# EAGLE design sensors (EAGLE 7.7.0)
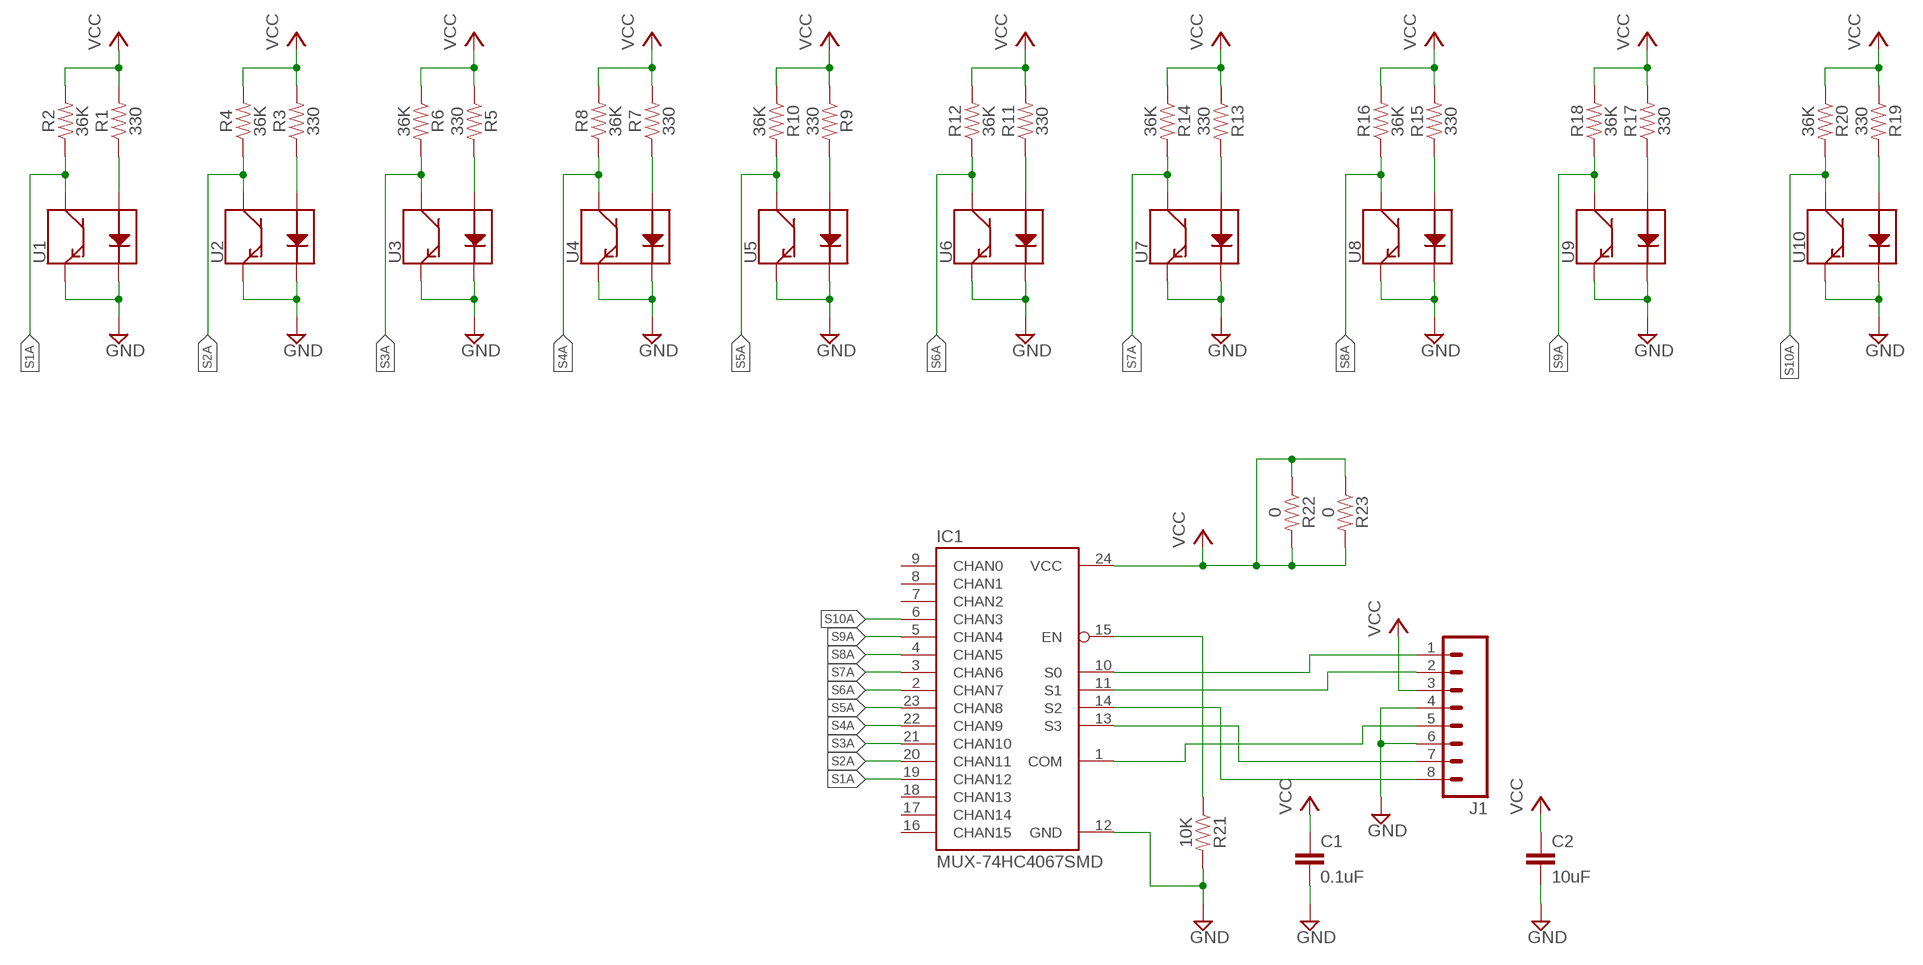
[diagram p0: schematic, sheet 1]

## Parts
C1  0.1uF  1.0UF-0805-25V-(+80/-20%)  [0805]
C2  10uF  1.0UF-0805-25V-(+80/-20%)  [0805]
IC1  MUX-74HC4067SMD  [SSOP24]
J1  M08  [1X08_ROUND]
R1  330  RESISTOR0805  [0805]
R2  36K  RESISTOR0805  [0805]
R3  330  RESISTOR0805  [0805]
R4  36K  RESISTOR0805  [0805]
R5  330  RESISTOR0805  [0805]
R6  36K  RESISTOR0805  [0805]
R7  330  RESISTOR0805  [0805]
R8  36K  RESISTOR0805  [0805]
R9  330  RESISTOR0805  [0805]
R10  36K  RESISTOR0805  [0805]
R11  330  RESISTOR0805  [0805]
R12  36K  RESISTOR0805  [0805]
R13  330  RESISTOR0805  [0805]
R14  36K  RESISTOR0805  [0805]
R15  330  RESISTOR0805  [0805]
R16  36K  RESISTOR0805  [0805]
R17  330  RESISTOR0805  [0805]
R18  36K  RESISTOR0805  [0805]
R19  330  RESISTOR0805  [0805]
R20  36K  RESISTOR0805  [0805]
R21  10K  RESISTOR0805  [0805]
R22  0  RESISTOR0805  [0805]
R23  0  RESISTOR0805  [0805]
U1  QRE1113SMD-W  [QRE1113-W]
U2  QRE1113SMD-W  [QRE1113-W]
U3  QRE1113SMD-W  [QRE1113-W]
U4  QRE1113SMD-W  [QRE1113-W]
U5  QRE1113SMD-W  [QRE1113-W]
U6  QRE1113SMD-W  [QRE1113-W]
U7  QRE1113SMD-W  [QRE1113-W]
U8  QRE1113SMD-W  [QRE1113-W]
U9  QRE1113SMD-W  [QRE1113-W]
U10  QRE1113SMD-W  [QRE1113-W]

## Nets
GND: C1.2 C2.2 IC1.12(GND) J1.4 J1.6 R21.2 U1.2(K) U1.4(E) U2.2(K) U2.4(E) U3.2(K) U3.4(E) U4.2(K) U4.4(E) U5.2(K) U5.4(E) U6.2(K) U6.4(E) U7.2(K) U7.4(E) U8.2(K) U8.4(E) U9.2(K) U9.4(E) U10.2(K) U10.4(E)
N$1: R1.1 U1.1(A)
N$2: IC1.13(S3) J1.7
N$3: R3.1 U2.1(A)
N$4: IC1.15(EN) R21.1
N$5: R5.2 U3.1(A)
N$6: IC1.14(S2) J1.8
N$7: R7.1 U4.1(A)
N$8: IC1.10(S0) J1.1
N$9: R9.2 U5.1(A)
N$10: IC1.11(S1) J1.2
N$11: R11.1 U6.1(A)
N$12: IC1.1(COM) J1.5
N$13: R13.2 U7.1(A)
N$15: R15.1 U8.1(A)
N$17: R17.1 U9.1(A)
N$19: R19.2 U10.1(A)
S1A: IC1.19(CHAN12) R2.1 U1.3(C)
S2A: IC1.20(CHAN11) R4.1 U2.3(C)
S3A: IC1.21(CHAN10) R6.2 U3.3(C)
S4A: IC1.22(CHAN9) R8.1 U4.3(C)
S5A: IC1.23(CHAN8) R10.2 U5.3(C)
S6A: IC1.2(CHAN7) R12.1 U6.3(C)
S7A: IC1.3(CHAN6) R14.2 U7.3(C)
S8A: IC1.4(CHAN5) R16.1 U8.3(C)
S9A: IC1.5(CHAN4) R18.1 U9.3(C)
S10A: IC1.6(CHAN3) R20.2 U10.3(C)
VCC: C1.1 C2.1 IC1.24(VCC) J1.3 R1.2 R2.2 R3.2 R4.2 R5.1 R6.1 R7.2 R8.2 R9.1 R10.1 R11.2 R12.2 R13.1 R14.1 R15.2 R16.2 R17.2 R18.2 R19.1 R20.1 R22.1 R22.2 R23.1 R23.2
Unconnected: IC1.7(CHAN2) IC1.8(CHAN1) IC1.9(CHAN0) IC1.16(CHAN15) IC1.17(CHAN14) IC1.18(CHAN13)

## Library data of the parts
C1 C2 = SparkFun-Capacitors:1.0UF: 1µF ceramic capacitors A capacitor is a passive two-terminal electrical component used to store electrical energy temporarily in an electric field.; PROD_ID: CAP-11625; VALUE: 1.0uF
IC1 = SeguidorLineasLbr:MUX-74HC4067
J1 = SparkFun-Connectors:M08: Header 8 Standard 8-pin 0.1" header. Use with straight break away headers (SKU : PRT-00116), right angle break away headers (PRT-00553), swiss pins (PRT-00743), machine pins (PRT-00117), and female headers (PRT-00115).; PROD_ID: CONN-08437
R1-R23 = SparkFun-Resistors:RESISTOR: Generic Resistor Package
U1-U10 = SparkFun-Sensors:QRE1113: QRE1113 Reflective Object Sensor The QRE1113 is a small IR reflectance sensor. This sensor is often used in line following robots because, if it can sense if a surface is white or black. There are four pins on the QRE1113 - two control the IR emitting LED while the other two are the collector and emitter of a phototransistor. The IR diode has a max forward current of 50mA and operates at 940nm. Datasheet <http://www.sparkfun.com/datasheets/Components/SMD/QRE1113.GR.pdf> SparkFun Products IR Reflectance Sensor - QRE1113 <https://www.sparkfun.com/products/9542> (COM-09542) SparkFun Line Sensor Breakout - QRE1113 (Analog) <https://www.sparkfun.com/products/9453> (ROB-09453) SparkFun Line Sensor Breakout - QRE1113 (Digital) <https://www.sparkfun.com/products/9454> (ROB-09454) SparkFun RedBot Sensor - Line Follower <https://www.sparkfun.com/products/11769> (SEN-11769) SparkFun RedBot Sensor - Wheel Encoder <https://www.sparkfun.com/products/12617> (SEN-12617) SparkFun Line Follower Array <https://www.sparkfun.com/products/13582> (SEN-13582); PROD_ID: IC-09357; SF_ID: COM-09542

## Board
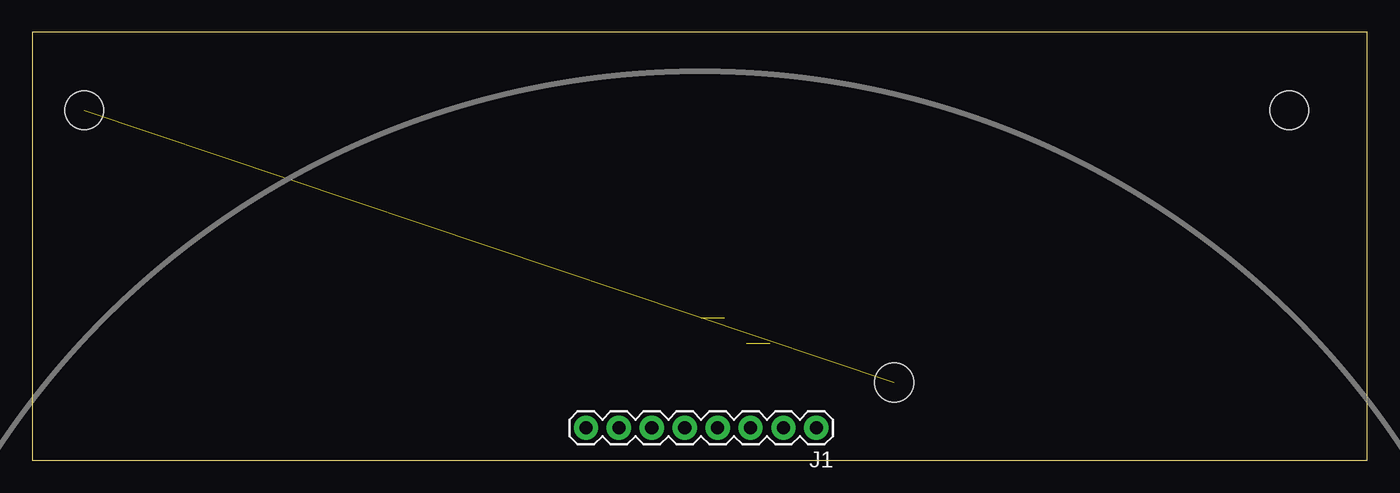
[diagram p1: board, top side]
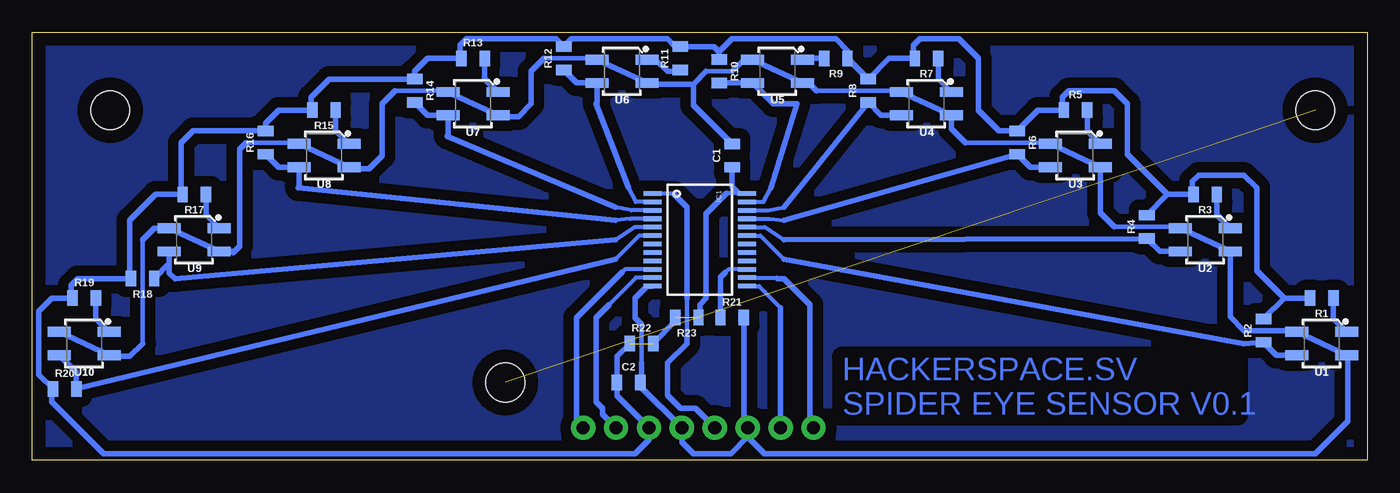
[diagram p2: board, bottom side, seen from below]

Size 103 x 33 mm. Coordinates in mm from the lower left corner, seen from the top.
Outline: 0,0 103,0 103,33 0,33 0,0
Copper layers (1*16): Top 0.035mm / dielectric 1.5mm / Bottom 0.035mm
Design rules "default": minimum track width 10mil, minimum drill 24mil, track to track 8mil, track to pad 8mil, pad to pad 8mil, via to via 8mil, smd to smd 8mil, copper to edge 40mil, drill to drill 8mil, minimum pad ring 10mil, minimum via ring 8mil, stop-mask expansion 4mil, vias tented up to drill 0mil, thermal gap 10mil
Holes 3 mm at 66.5,6 97,27 4,27

### Footprints (pad centres in the part's own frame; a part is rotated, then mirrored left to right if it is on the bottom)
0805 = smd 0.8 x 1.2: 1 -0.9,0; 2 0.9,0
SSOP24 = smd 0.348 x 1.397: 1 -3.575,-3.656; 2 -2.925,-3.656; 3 -2.275,-3.656; 4 -1.625,-3.656; 5 -0.975,-3.656; 6 -0.325,-3.656; 7 0.325,-3.656; 8 0.975,-3.656; 9 1.625,-3.656; 10 2.275,-3.656; 11 2.925,-3.656; 12 3.575,-3.656; 13 3.575,3.656; 14 2.925,3.656; 15 2.275,3.656; 16 1.625,3.656; 17 0.975,3.656; 18 0.325,3.656; 19 -0.325,3.656; 20 -0.975,3.656; 21 -1.625,3.656; 22 -2.275,3.656; 23 -2.925,3.656; 24 -3.575,3.656
1X08_ROUND = drill 1.016 pad 1.88: 1 0,0; 2 2.54,0; 3 5.08,0; 4 7.62,0; 5 10.16,0; 6 12.7,0; 7 15.24,0; 8 17.78,0
QRE1113-W = smd 1.778 x 0.762: 1 -1.927,-0.9; 2 1.927,-0.9; 3 1.927,0.9; 4 -1.927,0.9

### Placement (x,y rotation side)
C1  49,23.5 90 bottom
C2  57,6 0 bottom
IC1  51.5,17 270 bottom
J1  60.5,2.5 180 top
R1  3.5,12.5 180 bottom
R2  8,10 90 bottom
R3  12.5,20.5 180 bottom
R4  17,18 90 bottom
R5  22.5,27 0 bottom
R6  27,24.5 270 bottom
R7  34,31 180 bottom
R8  38.5,28.5 90 bottom
R9  41,31 180 bottom
R10  50,30 270 bottom
R11  53,31 90 bottom
R12  62,31 90 bottom
R13  69,31 0 bottom
R14  73.5,28.5 270 bottom
R15  80.5,27 180 bottom
R16  85,24.5 90 bottom
R17  90.5,20.5 180 bottom
R18  94.5,14 180 bottom
R19  99,12.5 0 bottom
R20  100.5,5.5 0 bottom
R21  49,11 0 bottom
R22  56,9 0 bottom
R23  52.5,11 180 bottom
U1  3.5,9 180 bottom
U2  12.5,17 180 bottom
U3  22.5,23.5 180 bottom
U4  34,27.5 180 bottom
U5  45.5,30 180 bottom
U6  57.5,30 180 bottom
U7  69,27.5 180 bottom
U8  80.5,23.5 180 bottom
U9  90.5,17 180 bottom
U10  99,9 180 bottom

### Tracks (layer width: path | path; a pad name or v marks a point on that pad's centre or on a via)
GND
  Bottom 0.356: 14.5,18 19.5,18 | 24.53,24.5 31,24.5 | 36.03,28.5 42.5,28.5 | 49,30 51,30 | 59.53,31 63.5,31 | 71.03,28.5 75,28.5 | 82.53,24.5 86.5,24.5 | 94.5,17 94.5,9 | 56,7.5 56,10.5
  Bottom 0.406: U10.2 U10.4 96.97,8 95.5,8 94.5,9 | 14.5,18 14.5,17.97 U2.2 U2.4 10.57,11.07 9.5,10 5.53,10 U1.2 U1.4 1.5,8.03 1.5,3 4,0.5 46.5,0.5 47.8,1.8 | 19.5,18 20.57,19.07 U3.4 U3.2 24.53,24.5 | 31,24.5 32.07,25.57 U4.4 U4.2 36.03,28.5 | 42.5,28.5 43.1,29.1 U5.4 U5.2 48.1,30.9 49,30 | 51,30 52,29 | 52,29 55.47,29 U6.4 U6.2 59.53,31 | 63.5,31 64.5,30 64.5,27.5 65.5,26.5 66.97,26.5 U7.4 U7.2 71.03,28.5 | 75,28.5 76,27.5 76,23.5 77,22.5 78.47,22.5 arc90 U8.4 U8.2 82.53,24.5 | 86.5,24.5 87,24 87,16.5 87.5,16 87.6,16.1 U9.4 U9.2 93.6,17.9 94.5,17 | 47.8,1.8 J1.6 48.1,2.8 R21.2 | 47.8,1.8 49.1,0.5 52,0.5 52.88,1.38 J1.4 56.1,5.72 C2.2 56,6.1 56,7.5 | C1.2 52,27.4 52,29 | IC1.12 55.58,13.43 56.5,12.5 56.5,11 56,10.5
N$1
  Bottom 0.406: U1.1 2.6,10.93 R1.1
N$2
  Bottom 0.305: IC1.13 46.92,13.43 46.5,13 45.26,11.76
  Bottom 0.406: 45.26,11.76 J1.7
N$3
  Bottom 0.406: U2.1 11.6,18.93 R3.1
N$4
  Bottom 0.305: IC1.15 49.27,14.72 49.5,14.5
  Bottom 0.406: 49.5,14.5 49.9,14.1 R21.1
N$5
  Bottom 0.406: U3.1 21.6,25.43 R5.2
N$6
  Bottom 0.305: IC1.14 45.58,14.07 arc90 45.5,14
  Bottom 0.406: 45.5,14 45,14 43,12 43,2.78 J1.8
N$7
  Bottom 0.406: U4.1 33.1,29.43 R7.1
N$8
  Bottom 0.305: IC1.10 57.27,14.72 57.5,14.5
  Bottom 0.406: 57.5,14.5 61,11 61,3 J1.1
N$9
  Bottom 0.406: U5.1 43.47,31 R9.2
N$10
  Bottom 0.305: IC1.11 56.42,14.07 58.5,12
  Bottom 0.406: J1.2 59,3.54 59,4 59.5,4.5 59.5,11 58.5,12
N$11
  Bottom 0.406: R11.1 53.1,30 54,30 54.9,30.9 U6.1
N$12
  Bottom 0.305: IC1.1 53.58,20.57 53.5,20.5
  Bottom 0.356: 52.5,9.5 52.5,12.5
  Bottom 0.406: 53.5,20.5 52.5,19.5 52.5,12.5 | J1.5 51.84,4 53,4 54,5 54,7.5 52.5,9 52.5,9.5
N$13
  Bottom 0.406: U7.1 68.1,29.43 R13.2
N$14
  pour Bottom (isolate 0.813): 0,0 0,33 103,33 103,0
N$15
  Bottom 0.406: U8.1 79.6,25.43 R15.1
N$16  (via drill 1)  (1 unrouted)
  other vias: 66.5,6 4,27 97,27
N$17
  Bottom 0.406: U9.1 89.6,18.93 R17.1
N$19
  Bottom 0.406: U10.1 98.1,10.93 R19.2
S1A
  Bottom 0.305: IC1.19 46.83,17.32 45,15.5
  Bottom 0.406: U1.3 7,8.1 R2.1 9.5,9 45,15.5
S2A
  Bottom 0.305: IC1.20 46.48,17.98 45,17
  Bottom 0.406: 45,17 R4.1 16,16.1 U2.3
S3A
  Bottom 0.305: IC1.21 46.12,18.62 45,18.5
  Bottom 0.406: U3.3 26,22.6 R6.2 45,18.5
S4A
  Bottom 0.305: IC1.22 46.23,19.27 45,19.5
  Bottom 0.406: U4.3 37.5,26.6 R8.1 45,19.5
S5A
  Bottom 0.305: IC1.23 46.58,19.93 46,21
  Bottom 0.406: 46,21 44,27.5 45.83,27.5 U5.3 R10.2
S6A
  Bottom 0.305: IC1.2 56.42,19.93 57,21
  Bottom 0.406: R12.1 61,29.1 U6.3 59.43,27.57 59.5,27.5 57,21
S7A
  Bottom 0.305: IC1.3 56.77,19.27 58,19.5
  Bottom 0.406: R14.2 72.5,26.6 U7.3 70.93,25.07 71,25 58,19.5
S8A
  Bottom 0.305: IC1.4 56.88,18.62 58,18.5
  Bottom 0.406: R16.1 84,22.6 U8.3 82.43,21.07 82.5,21 58,18.5
S9A
  Bottom 0.305: IC1.5 56.52,17.98 58,17
  Bottom 0.406: R18.1 92.43,15.17 U9.3 92.43,14.43 92,14 58,17
S10A
  Bottom 0.305: IC1.6 56.17,17.32 58,15.5
  Bottom 0.406: U10.3 99.6,6.77 R20.2 58,15.5
VCC  (2 unrouted)
  Bottom 0.305: IC1.24 48.5,20.57 49.42,20.57
  Bottom 0.406: R1.2 6.4,12.5 | 6.4,12.5 R2.2 | 15.4,20.5 R3.2 13.5,20.6 13.5,21.5 13,22 9.5,22 8.5,21 8.5,14.6 6.4,12.5 | 15.4,20.5 R4.2 | 50,31.5 49,32.5 41,32.5 40.1,31.6 R9.1 R8.2 36.9,31 R7.2 35,31.1 35,32 34.5,32.5 31.5,32.5 30,31 30,27 28.4,25.4 R6.1 25.4,27 R5.1 23.5,27.1 23.5,28 23,28.5 19.5,28.5 18.5,27.5 18.5,23.6 15.4,20.5 | 50,31.5 R10.1 | 50,31.5 50.4,31.9 R11.2 53.4,31.9 54,32.5 61.4,32.5 R12.2 62.6,32.5 69.5,32.5 70,32 70,31.1 R13.1 72.5,31 73.5,30 R14.1 80.1,29.4 81.5,28 81.5,27.1 R15.2 84,27 85,26 R16.2 90.6,25.4 91.5,24.5 91.5,20.6 R17.2 93.5,20.5 95.5,18.5 95.5,14.1 R18.2 99.5,14 100,13.5 100,12.6 R19.1 101.5,12.5 102.5,11.5 102.5,6.6 R20.1 101.5,5.4 101.5,4.5 97.5,0.5 56.5,0.5 55.42,1.58 J1.3 57.9,4.98 C2.1 57.9,8 R22.1 | C1.1 49,21.07 48.5,20.57 | R22.2 53.4,10.7 R23.2 | R23.1 51.5,11.1 51.5,12 51,12.5 51,19 49.42,20.57

### Text on the board
Bottom: HACKERSPACE.SV / SPIDER EYE SENSOR V0.1